# EAGLE design bender_head (EAGLE 7.2.0)
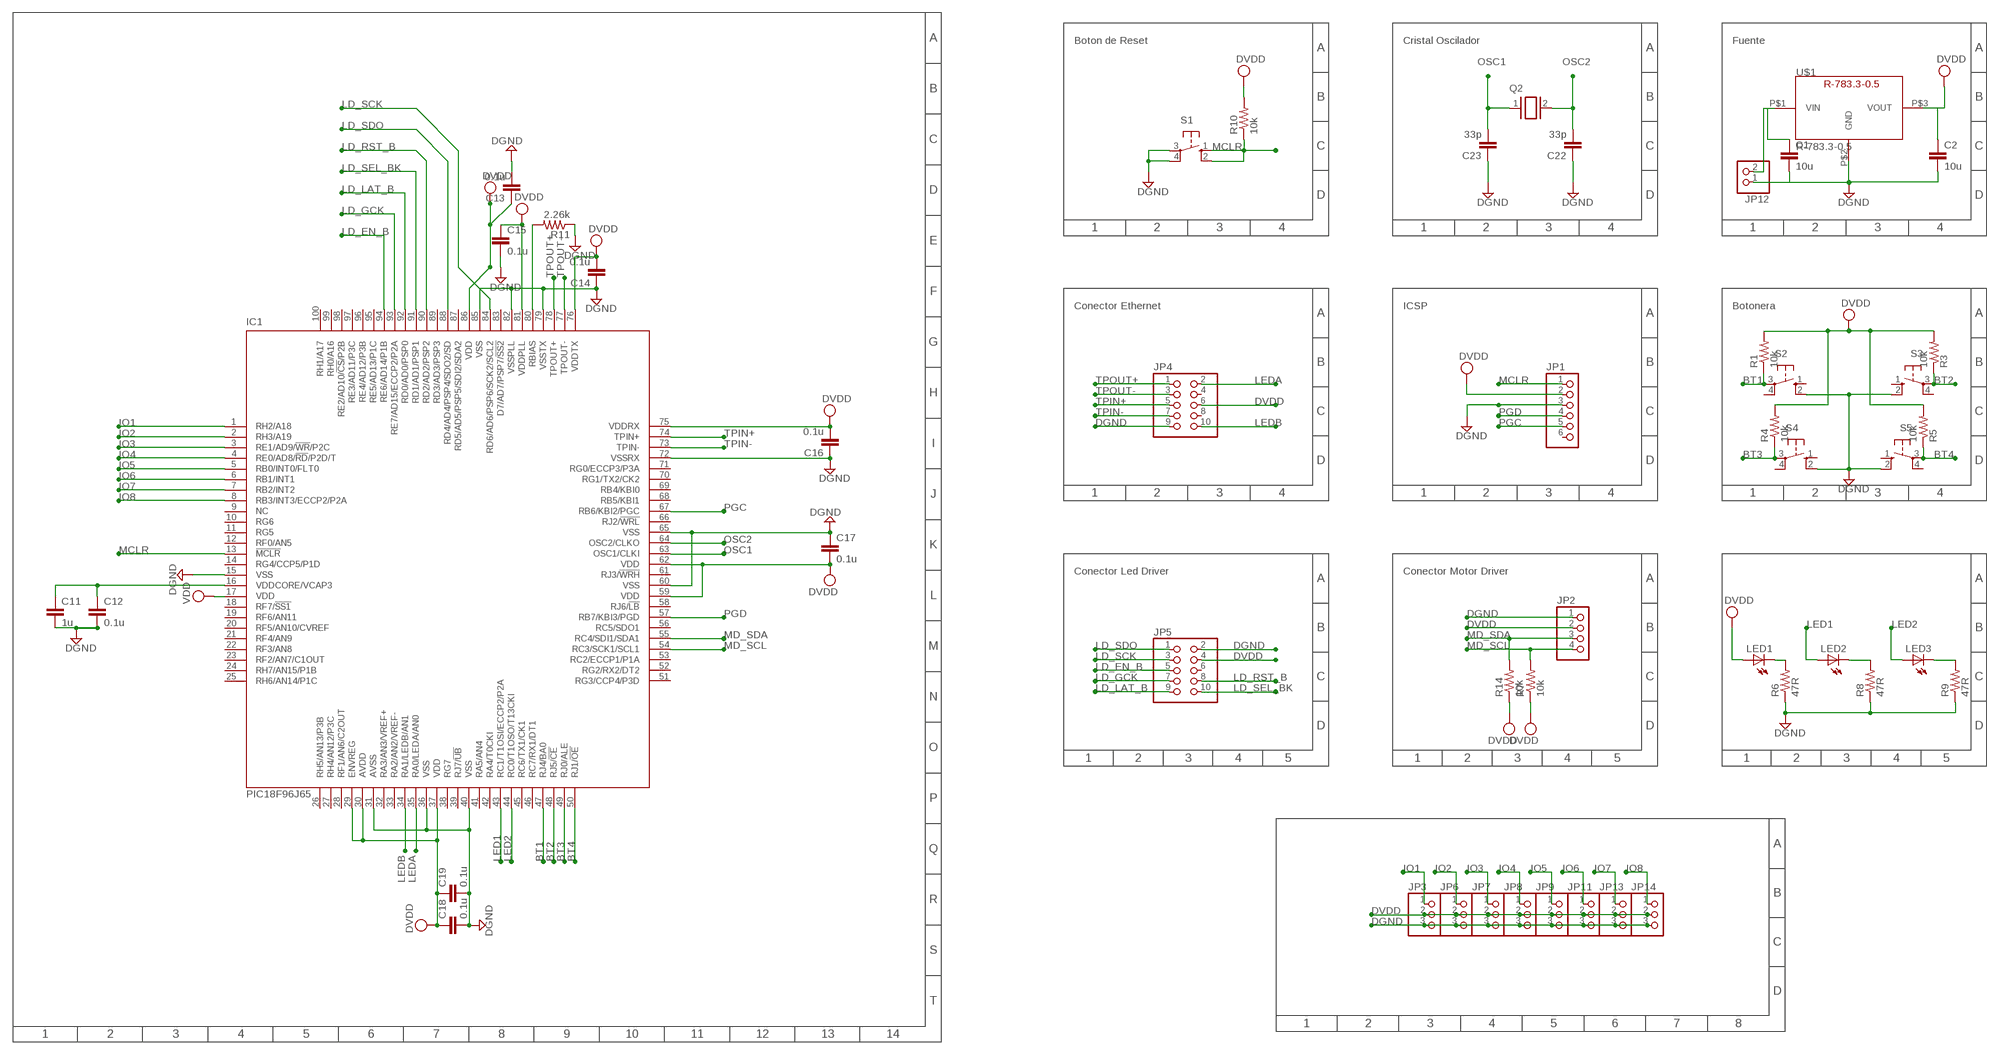
[diagram p0: schematic, sheet 1]

## Parts
C1  10u  C-EUC1206  [C1206]
C2  10u  C-EUC1206  [C1206]
C11  1u  C-EUC1206  [C1206]
C12  0.1u  C-EUC0805  [C0805]
C13  0.1u  C-EUC0805  [C0805]
C14  0.1u  C-EUC0805  [C0805]
C15  0.1u  C-EUC0805  [C0805]
C16  0.1u  C-EUC0805  [C0805]
C17  0.1u  C-EUC0805  [C0805]
C18  0.1u  C-EUC0805  [C0805]
C19  0.1u  C-EUC0805  [C0805]
C22  33p  C-EUC1206  [C1206]
C23  33p  C-EUC1206  [C1206]
IC1  PIC18F96J65  [TQFP100]
JP1  PINHD-1X6  [1X06]
JP2  PINHD-1X4/90  [1X04/90]
JP3  PINHD-1X3  [1X03]
JP4  PINHD-2X5/90  [2X05/90]
JP5  PINHD-2X5/90  [2X05/90]
JP6  PINHD-1X3  [1X03]
JP7  PINHD-1X3  [1X03]
JP8  PINHD-1X3  [1X03]
JP9  PINHD-1X3  [1X03]
JP11  PINHD-1X3  [1X03]
JP12  PINHD-1X2/90  [1X02/90]
JP13  PINHD-1X3  [1X03]
JP14  PINHD-1X3  [1X03]
LED1  LEDSML0805  [SML0805]
LED2  LEDSML0805  [SML0805]
LED3  LEDSML0805  [SML0805]
Q2  XTAL/S  [QS]
R1  10k  R-US_R1206  [R1206]
R3  10k  R-US_R1206  [R1206]
R4  10k  R-US_R1206  [R1206]
R5  10k  R-US_R1206  [R1206]
R6  47R  R-US_M0805  [M0805]
R7  10k  R-US_R1206  [R1206]
R8  47R  R-US_M1206  [M1206]
R9  47R  R-US_M1206  [M1206]
R10  10k  R-US_R1206  [R1206]
R11  2.26k  R-US_R1206  [R1206]
R14  10k  R-US_R1206  [R1206]
S1  10-XX  [B3F-10XX]
S2  10-XX  [B3F-10XX]
S3  10-XX  [B3F-10XX]
S4  10-XX  [B3F-10XX]
S5  10-XX  [B3F-10XX]
U$1  R-783.3-0.5  [R-783.3-0.5]

## Nets
BT1: IC1.47(RJ4/BA0) R1.1 S2.3(P)
BT2: IC1.48(RJ5/!CE) R3.1 S3.3(P)
BT3: IC1.49(RJ0/ALE) R4.1 S4.3(P)
BT4: IC1.50(RJ1/!OE) R5.1 S5.3(P)
DGND: C1.2 C2.2 C11.2 C12.2 C13.2 C14.1 C15.2 C16.1 C17.1 C18.2 C19.2 C22.1 C23.1 IC1.15(VSS) IC1.31(AVSS) IC1.36(VSS) IC1.40(VSS) IC1.60(VSS) IC1.65(VSS) IC1.72(VSSRX) IC1.79(VSSTX) IC1.82(VSSPLL) IC1.85(VSS) JP1.3 JP2.1 JP3.3 JP4.9 JP5.2 JP6.3 JP7.3 JP8.3 JP9.3 JP11.3 JP12.1 JP13.3 JP14.3 R6.1 R8.1 R9.1 R11.1 S1.3(P) S1.4(P1) S2.2(S1) S3.2(S1) S4.2(S1) S5.2(S1) U$1.P$2(GND)
DVDD: C2.1 C13.1 C14.2 C15.1 C16.2 C17.2 C18.1 C19.1 IC1.17(VDD) IC1.29(ENVREG) IC1.30(AVDD) IC1.37(VDD) IC1.59(VDD) IC1.62(VDD) IC1.75(VDDRX) IC1.76(VDDTX) IC1.81(VDDPLL) IC1.86(VDD) JP1.2 JP2.2 JP3.2 JP4.6 JP5.4 JP6.2 JP7.2 JP8.2 JP9.2 JP11.2 JP13.2 JP14.2 LED1.A R1.2 R3.2 R4.2 R5.2 R7.1 R10.2 R14.1 U$1.P$3(VOUT) ; supply symbol labelled VDD
IO1: IC1.1(RH2/A18) JP3.1
IO2: IC1.2(RH3/A19) JP6.1
IO3: IC1.3(RE1/AD9/!WR!/P2C) JP7.1
IO4: IC1.4(RE0/AD8/!RD!/P2D/T) JP8.1
IO5: IC1.5(RB0/INT0/FLT0) JP9.1
IO6: IC1.6(RB1/INT1) JP11.1
IO7: IC1.7(RB2/INT2) JP13.1
IO8: IC1.8(RB3/INT3/ECCP2/P2A) JP14.1
LD_EN_B: IC1.94(RE6/AD14/P1B) JP5.5
LD_GCK: IC1.93(RE7/AD15/ECCP2/P2A) JP5.7
LD_LAT_B: IC1.92(RD0/AD0/PSP0) JP5.9
LD_RST_B: IC1.90(RD2/AD2/PSP2) JP5.8
LD_SCK: IC1.84(RD6/AD6/PSP6/SCK2/SCL2) JP5.3
LD_SDO: IC1.88(RD4/AD4/PSP4/SDO2/SD) JP5.1
LD_SEL_BK: IC1.91(RD1/AD1/PSP1) JP5.10
LED1: IC1.43(RC1/T1OSI/ECCP2/P2A) LED2.A
LED2: IC1.44(RC0/T1OSO/T13CKI) LED3.A
LEDA: IC1.35(RA0/LEDA/AN0) JP4.2
LEDB: IC1.34(RA1/LEDB/AN1) JP4.10
MCLR: IC1.13(!MCLR) JP1.1 R10.1 S1.1(S) S1.2(S1)
MD_SCL: IC1.54(RC3/SCK1/SCL1) JP2.4 R7.2
MD_SDA: IC1.55(RC4/SDI1/SDA1) JP2.3 R14.2
N$1: LED1.C R6.2
N$2: LED2.C R8.2
N$3: LED3.C R9.2
N$8: C11.1 C12.1 IC1.16(VDDCORE/VCAP3)
N$12: IC1.80(RBIAS) R11.2
OSC1: C23.2 IC1.63(OSC1/CLKI) Q2.1
OSC2: C22.2 IC1.64(OSC2/CLKO) Q2.2
PGC: IC1.67(RB6/KBI2/PGC) JP1.5
PGD: IC1.57(RB7/KBI3/PGD) JP1.4
TPIN+: IC1.74(TPIN+) JP4.5
TPIN-: IC1.73(TPIN-) JP4.7
TPOUT+: IC1.78(TPOUT+) JP4.1
TPOUT-: IC1.77(TPOUT-) JP4.3
VIN: C1.1 JP12.2 U$1.P$1(VIN)
Unconnected: IC1.9(NC) IC1.10(RG6) IC1.11(RG5) IC1.12(RF0/AN5) IC1.14(RG4/CCP5/P1D) IC1.18(RF7/!SS1) IC1.19(RF6/AN11) IC1.20(RF5/AN10/CVREF) IC1.21(RF4/AN9) IC1.22(RF3/AN8) IC1.23(RF2/AN7/C1OUT) IC1.24(RH7/AN15/P1B) IC1.25(RH6/AN14/P1C) IC1.26(RH5/AN13/P3B) IC1.27(RH4/AN12/P3C) IC1.28(RF1/AN6/C2OUT) IC1.32(RA3/AN3/VREF+) IC1.33(RA2/AN2/VREF-) IC1.38(RG7) IC1.39(RJ7/!UB) IC1.41(RA5/AN4) IC1.42(RA4/T0CKI) IC1.45(RC6/TX1/CK1) IC1.46(RC7/RX1/DT1) IC1.51(RG3/CCP4/P3D) IC1.52(RG2/RX2/DT2) IC1.53(RC2/ECCP1/P1A) IC1.56(RC5/SDO1) IC1.58(RJ6/!LB) IC1.61(RJ3/!WRH) IC1.66(RJ2/!WRL) IC1.68(RB5/KBI1) IC1.69(RB4/KBI0) IC1.70(RG1/TX2/CK2) IC1.71(RG0/ECCP3/P3A) IC1.83(D7/AD7/PSP7/!SS2) IC1.87(RD5/AD5/PSP5/SDI2/SDA2) IC1.89(RD3/AD3/PSP3) IC1.95(RE5/AD13/P1C) IC1.96(RE4/AD12/P3B) IC1.97(RE3/AD11/P3C) IC1.98(RE2/AD10/!CS!/P2B) IC1.99(RH0/A16) IC1.100(RH1/A17) JP1.6 JP4.4 JP4.8 JP5.6 S2.1(S) S2.4(P1) S3.1(S) S3.4(P1) S4.1(S) S4.4(P1) S5.1(S) S5.4(P1)

## Notes on the sheet
- Boton de Reset | Cristal Oscilador | Fuente
- Conector Ethernet | ICSP | Botonera
- Conector Led Driver | Conector Motor Driver

## Library data of the parts
C1 C2 C11-C19 C22 C23 = rcl:C-EU: CAPACITOR, European symbol
IC1 = microchip:PIC18F9*J6: PIC18F97J60 Family 64/80/100-Pin High-Performance, 1-Mbit Flash Microcontrollers with Ethernet Source: http://ww1.microchip.com/downloads/en/DeviceDoc/39762d.pdf
JP1 = pinhead:PINHD-1X6: PIN HEADER
JP2 = pinhead:PINHD-1X4: PIN HEADER
JP3 JP6-JP9 JP11 JP13 JP14 = pinhead:PINHD-1X3: PIN HEADER
JP4 JP5 = pinhead:PINHD-2X5: PIN HEADER
JP12 = pinhead:PINHD-1X2: PIN HEADER
LED1-LED3 = led:LED: LED OSRAM: - CHIPLED LG R971, LG N971, LY N971, LG Q971, LY Q971, LO R971, LY R971 LH N974, LH R974 LS Q976, LO Q976, LY Q976 LO Q996 - Hyper CHIPLED LW Q18S LB Q993, LB Q99A, LB R99A - SideLED LS A670, LO A670, LY A670, LG A670, LP A670 LB A673, LV A673, LT A673, LW A673 LH A674 LY A675 LS A676, LA A676, LO A676, LY A676, LW A676 LS A679, LY A679, LG A679 - Hyper Micro SIDELED® LS Y876, LA Y876, LO Y876, LY Y876 LT Y87S - SmartLED LW L88C, LW L88S LB L89C, LB L89S, LG L890 LS L89K, LO L89K, LY L89K LS L896, LA L896, LO L896, LY L896 - TOPLED LS T670, LO T670, LY T670, LG T670, LP T670 LSG T670, LSP T670, LSY T670, LOP T670, LYG T670 LG T671, LOG T671, LSG T671 LB T673, LV T673, LT T673, LW T673 LH T674 LS T676, LA T676, LO T676, LY T676, LB T676, LH T676, LSB T676, LW T676 LB T67C, LV T67C, LT T67C, LS T67K, LO T67K, LY T67K, LW E67C LS E67B, LA E67B, LO E67B, LY E67B, LB E67C, LV E67C, LT E67C LW T67C LS T679, LY T679, LG T679 LS T770, LO T770, LY T770, LG T770, LP T770 LB T773, LV T773, LT T773, LW T773 LH T774 LS E675, LA E675, LY E675, LS T675 LS T776, LA T776, LO T776, LY T776, LB T776 LHGB T686 LT T68C, LB T68C - Hyper Mini TOPLED® LB M676 - Mini TOPLED Santana® LG M470 LS M47K, LO M47K, LY M47K Source: http://www.osram.convergy.de LUXEON: - LUMILED® LXK2-PW12-R00, LXK2-PW12-S00, LXK2-PW14-U00, LXK2-PW14-V00 LXK2-PM12-R00, LXK2-PM12-S00, LXK2-PM14-U00 LXK2-PE12-Q00, LXK2-PE12-R00, LXK2-PE12-S00, LXK2-PE14-T00, LXK2-PE14-U00 LXK2-PB12-K00, LXK2-PB12-L00, LXK2-PB12-M00, LXK2-PB14-N00, LXK2-PB14-P00, LXK2-PB14-Q00 LXK2-PR12-L00, LXK2-PR12-M00, LXK2-PR14-Q00, LXK2-PR14-R00 LXK2-PD12-Q00, LXK2-PD12-R00, LXK2-PD12-S00 LXK2-PH12-R00, LXK2-PH12-S00 LXK2-PL12-P00, LXK2-PL12-Q00, LXK2-PL12-R00 Source: www.luxeon.com KINGBRIGHT: KA-3528ASYC Source: www.kingbright.com
Q2 = special:XTAL/S: CRYSTAL
R1 R3-R11 R14 = rcl:R-US_: RESISTOR, American symbol
S1-S5 = switch-omron:10-XX: OMRON SWITCH
U$1 = cabeza_bender:R-783.3-0.5

## Board
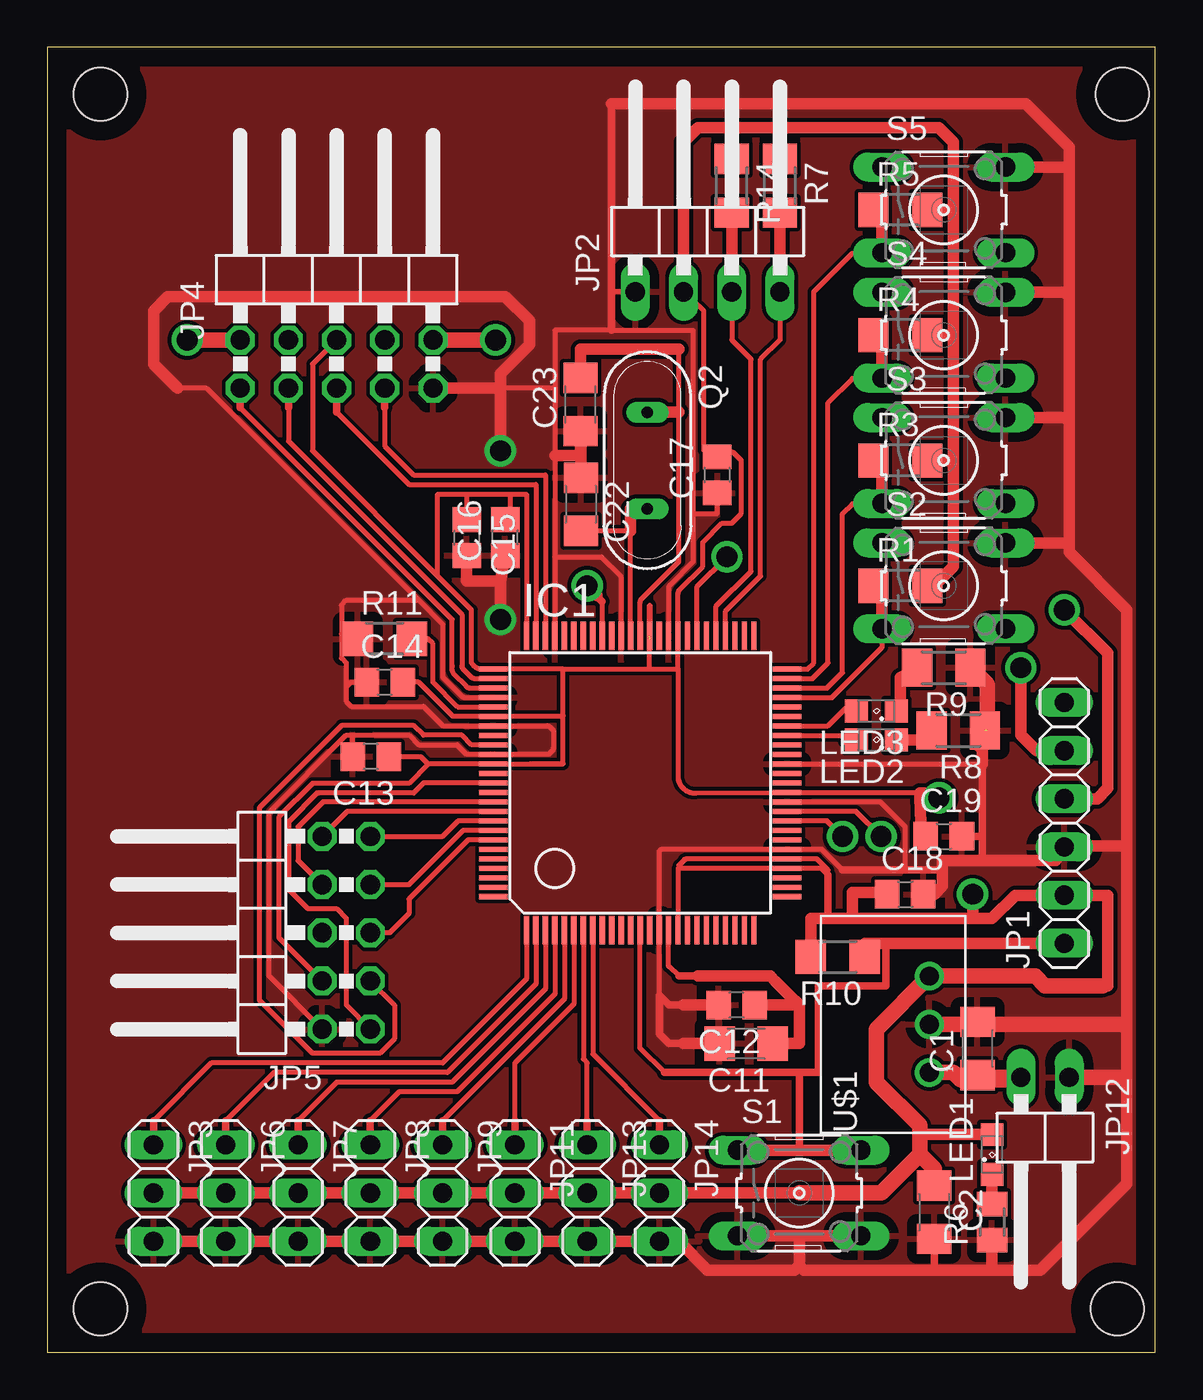
[diagram p1: board, top side]
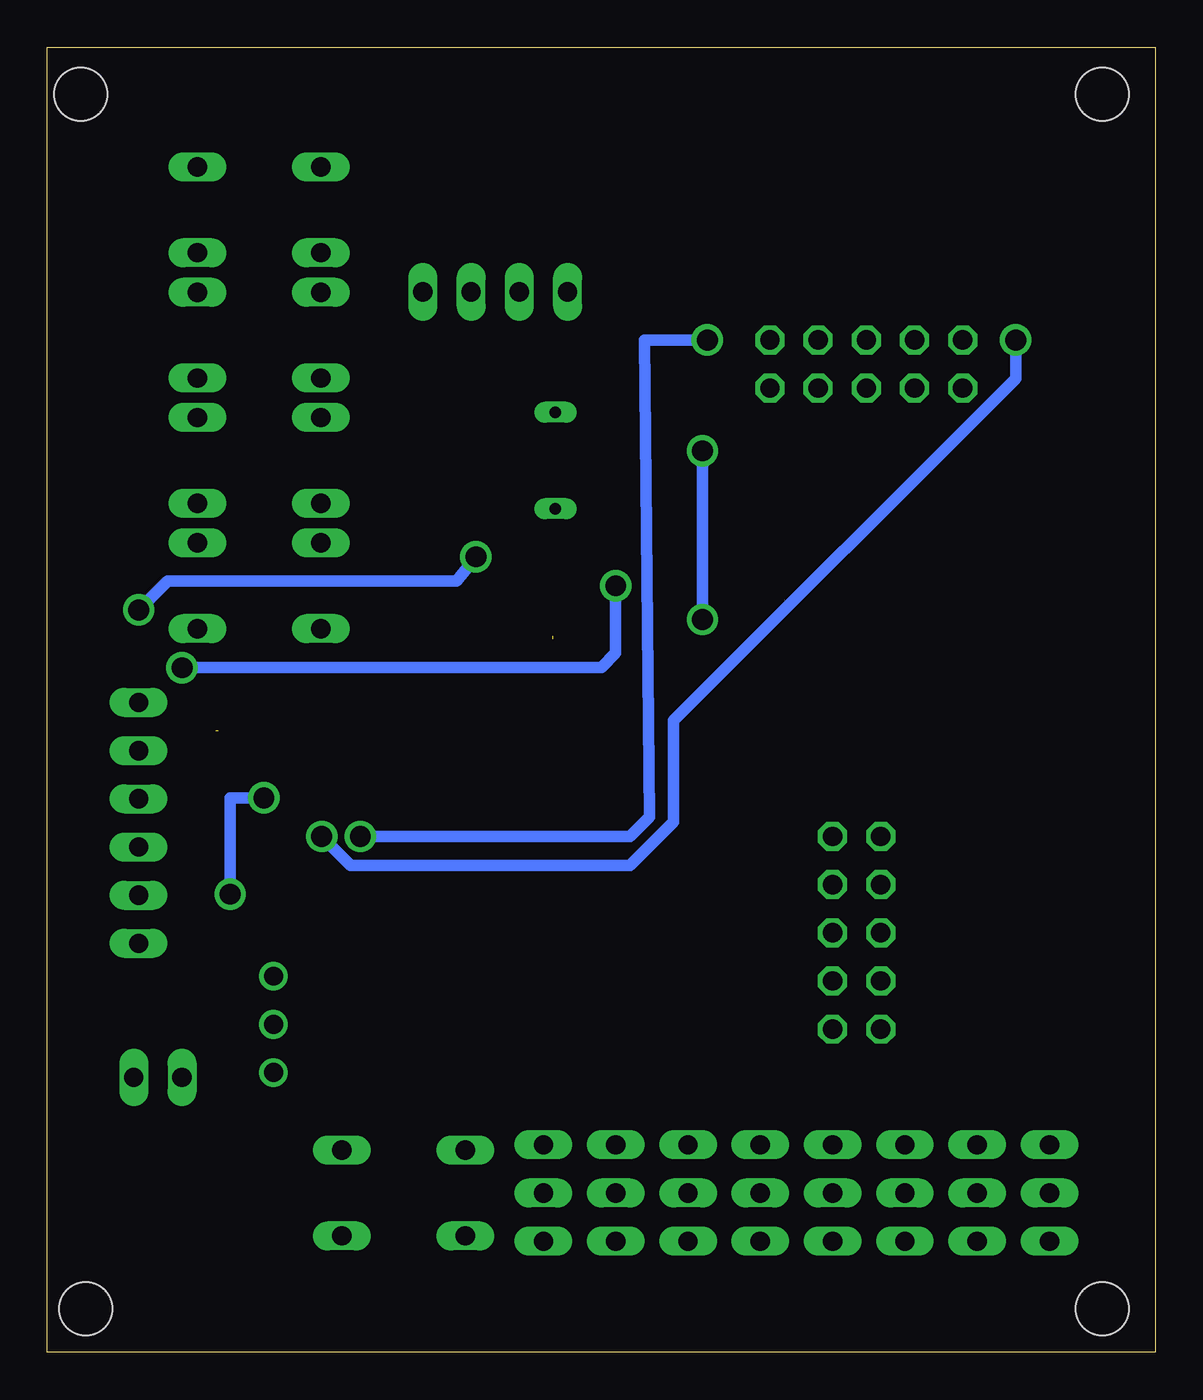
[diagram p2: board, bottom side, seen from below]

Size 58.4 x 68.76 mm. Coordinates in mm from the lower left corner, seen from the top.
Outline: 0,0 58.4,0 58.4,68.76 0,68.76 0,0
Copper layers (1*16): Top 0.035mm / dielectric 1.5mm / Bottom 0.035mm
Design rules "default": minimum track width 10mil, minimum drill 24mil, track to track 8mil, track to pad 8mil, pad to pad 8mil, via to via 8mil, smd to smd 8mil, copper to edge 40mil, drill to drill 8mil, minimum pad ring 10mil, minimum via ring 8mil, stop-mask expansion 4mil, vias tented up to drill 0mil, thermal gap 20mil
Holes 2.8 mm at 2.79,66.29 56.64,66.29 56.39,2.29 2.79,2.29

### Footprints (pad centres in the part's own frame; a part is rotated, then mirrored left to right if it is on the bottom)
C1206 = smd 1.6 x 1.8: 1 -1.4,0; 2 1.4,0
C0805 = smd 1.3 x 1.5: 1 -0.95,0; 2 0.95,0
TQFP100 = smd 0.27 x 1.5: 1 -6,-7.75; 2 -5.5,-7.75; 3 -5,-7.75; 4 -4.5,-7.75; 5 -4,-7.75; 6 -3.5,-7.75; 7 -3,-7.75; 8 -2.5,-7.75; 9 -2,-7.75; 10 -1.5,-7.75; 11 -1,-7.75; 12 -0.5,-7.75; 13 0,-7.75; 14 0.5,-7.75; 15 1,-7.75; 16 1.5,-7.75; 17 2,-7.75; 18 2.5,-7.75; 19 3,-7.75; 20 3.5,-7.75; 21 4,-7.75; 22 4.5,-7.75; 23 5,-7.75; 24 5.5,-7.75; 25 6,-7.75; 51 6,7.75; 52 5.5,7.75; 53 5,7.75; 54 4.5,7.75; 55 4,7.75; 56 3.5,7.75; 57 3,7.75; 58 2.5,7.75; 59 2,7.75; 60 1.5,7.75; 61 1,7.75; 62 0.5,7.75; 63 0,7.75; 64 -0.5,7.75; 65 -1,7.75; 66 -1.5,7.75; 67 -2,7.75; 68 -2.5,7.75; 69 -3,7.75; 70 -3.5,7.75; 71 -4,7.75; 72 -4.5,7.75; 73 -5,7.75; 74 -5.5,7.75; 75 -6,7.75 | smd 1.5 x 0.27: 26 7.75,-6; 27 7.75,-5.5; 28 7.75,-5; 29 7.75,-4.5; 30 7.75,-4; 31 7.75,-3.5; 32 7.75,-3; 33 7.75,-2.5; 34 7.75,-2; 35 7.75,-1.5; 36 7.75,-1; 37 7.75,-0.5; 38 7.75,0; 39 7.75,0.5; 40 7.75,1; 41 7.75,1.5; 42 7.75,2; 43 7.75,2.5; 44 7.75,3; 45 7.75,3.5; 46 7.75,4; 47 7.75,4.5; 48 7.75,5; 49 7.75,5.5; 50 7.75,6; 76 -7.75,6; 77 -7.75,5.5; 78 -7.75,5; 79 -7.75,4.5; 80 -7.75,4; 81 -7.75,3.5; 82 -7.75,3; 83 -7.75,2.5; 84 -7.75,2; 85 -7.75,1.5; 86 -7.75,1; 87 -7.75,0.5; 88 -7.75,0; 89 -7.75,-0.5; 90 -7.75,-1; 91 -7.75,-1.5; 92 -7.75,-2; 93 -7.75,-2.5; 94 -7.75,-3; 95 -7.75,-3.5; 96 -7.75,-4; 97 -7.75,-4.5; 98 -7.75,-5; 99 -7.75,-5.5; 100 -7.75,-6
1X06 = drill 1.016 long: 1 -6.35,0; 2 -3.81,0; 3 -1.27,0; 4 1.27,0; 5 3.81,0; 6 6.35,0
1X04/90 = drill 1.016 long: 1 -3.81,-3.81; 2 -1.27,-3.81; 3 1.27,-3.81; 4 3.81,-3.81
1X03 = drill 1.016 long: 1 -2.54,0; 2 0,0; 3 2.54,0
2X05/90 = drill 1.016 octagon: 1 -5.08,-6.35; 2 -5.08,-3.81; 3 -2.54,-6.35; 4 -2.54,-3.81; 5 0,-6.35; 6 0,-3.81; 7 2.54,-6.35; 8 2.54,-3.81; 9 5.08,-6.35; 10 5.08,-3.81
1X02/90 = drill 1.016 long: 1 -1.27,-3.81; 2 1.27,-3.81
SML0805 = smd 1.2 x 1.2: A 1.05,0; C -1.05,0
QS = drill 0.61 long: 1 -2.54,0; 2 2.54,0
R1206 = smd 1.6 x 1.803: 1 -1.422,0; 2 1.422,0
M0805 = smd 1.3 x 1.6: 1 -0.95,0; 2 0.95,0
M1206 = smd 1.6 x 2: 1 -1.4,0; 2 1.4,0
B3F-10XX = drill 1.016 long: 1 -3.251,2.261; 2 3.251,2.261; 3 -3.251,-2.261; 4 3.251,-2.261
R-783.3-0.5 = drill 1: P$1 -2.54,-2.54; P$2 0,-2.54; P$3 2.54,-2.54

### Placement (x,y rotation side)
C1  49.02,16 90 top
C2  46.74,7.37 270 top
C11  36.83,16.26 180 top
C12  36.32,18.29 180 top
C13  17.05,31.38 180 top
C14  17.78,35.31 0 top
C15  22.1,42.93 270 top
C16  24.13,42.93 90 top
C17  35.31,46.23 90 top
C18  45.21,24.13 0 top
C19  47.24,27.18 0 top
C22  28.12,44.68 270 top
C23  28.09,49.94 90 top
IC1  31.24,30 0 top
JP1  53.59,27.89 90 top
JP2  34.8,59.69 0 top
JP3  5.59,8.38 270 top
JP4  15.24,57.15 0 top
JP5  10.67,22.1 90 top
JP6  9.4,8.38 270 top
JP7  13.21,8.38 270 top
JP8  17.02,8.38 270 top
JP9  20.83,8.38 270 top
JP11  24.64,8.38 270 top
JP12  52.58,10.67 180 top
JP13  28.45,8.38 270 top
JP14  32.26,8.38 270 top
LED1  49.78,10.41 90 top
LED2  43.69,32.26 180 top
LED3  43.69,33.78 180 top
Q2  31.62,46.99 270 top
R1  44.96,40.39 0 top
R3  44.96,46.99 0 top
R4  44.96,53.59 0 top
R5  44.96,60.2 0 top
R6  49.78,6.86 90 top
R7  38.61,61.47 270 top
R8  48.01,32.77 180 top
R9  47.24,36.07 180 top
R10  41.66,20.83 180 top
R11  17.78,37.59 0 top
R14  36.07,61.47 270 top
S1  39.62,8.38 0 top
S2  47.24,40.39 0 top
S3  47.24,46.99 0 top
S4  47.24,53.59 0 top
S5  47.24,60.2 0 top
U$1  43.94,17.27 90 top

### Tracks (layer width: path | path; a pad name or v marks a point on that pad's centre or on a via)
BT1
  Top 0.254: IC1.47 41.36,34.5 43.99,37.13 S2.3
  Top 0.61: S2.3 43.99,39.93 R1.1
BT2
  Top 0.254: IC1.48 41.09,35 41.91,35.81 41.91,44.2 42.42,44.7 43.97,44.7 S3.3
  Top 0.61: S3.3 43.99,46.53 R3.1
BT3
  Top 0.254: IC1.49 40.32,35.5 41.15,36.32 41.15,50.04 42.42,51.31 43.97,51.31 S4.3
  Top 0.61: S4.3 43.99,53.14 R4.1
BT4
  Top 0.254: IC1.50 40.06,36 40.39,36.32 40.39,55.88 42.42,57.91 43.97,57.91 S5.3
  Top 0.61: S5.3 43.99,59.74 R5.1
DGND  (via drill 1.1)  (2 unrouted)
  Top 0.254: 26.74,41.91 IC1.72 | 26.74,41.91 26.74,47.24 26.74,50.8 | 34.04,44.2 35.31,44.2 C17.1 | 34.04,44.2 34.04,53.85 29.72,53.85 26.74,53.85 26.74,50.8 | 26.74,50.8 23.88,50.8 | 41.91,25.4 40.81,26.5 IC1.31 32.42,26.5 arc90 32.24,26.32 IC1.15 32.24,18.81 32.26,18.8 | 48.26,25.91 48.19,25.97 | IC1.36 43.9,29 45.21,27.69 45.21,25.4 | IC1.60 32.74,40.26 arc-45 32.82,40.44 34.04,41.66 34.04,44.2 | IC1.65 30.24,40.77 arc45 30.17,40.95 29.21,41.91 26.74,41.91 | IC1.79 22,34.5 arc-45 21.82,34.57 20.9,35.49 arc-45 20.83,35.66 20.83,38.35 19.56,39.62 15.75,39.62 15.49,39.37 15.49,37.85 | 19.56,39.63 8.38,50.8 6.86,50.8 | 15.49,37.85 15.75,37.59 R11.1 | 15.75,35.05 16,35.31 C14.1 | 15.75,35.05 15.75,36.32 15.49,36.58 15.49,37.85 | 15.75,35.05 15.75,34.29 16,34.04 19.81,34.04 20.85,33 IC1.82 26.33,33 arc-45 26.51,32.92 26.67,32.77 26.67,31.86 arc-45 26.6,31.68 26.42,31.5 IC1.85 arc-45 IC1.85 22.1,31.5 21.59,32 19.56,32 19.05,32.51 16,32.51 | 23.62,50.8 23.88,50.55 | JP2.1 29.72,55.88 | IC1.40 48.25,31 49.28,30.99 | 56.64,17.27 56.9,17.27 | 56.64,14.48 56.9,14.48 | C13.2 16.1,32.42 16,32.51 | 16,32.51 15.75,32.51 11.68,28.45 11.68,19.81 JP5.2
  Top 0.406: 56.9,8.87 56.9,8.89 | 53.59,26.67 JP1.3 | 29.72,65.79 29.72,55.88 29.72,53.85 | 47.18,25.4 45.21,25.4 41.91,25.4 | 49.28,25.91 49.28,27.18 | 49.28,27.18 49.28,30.99 | 49.28,27.18 C19.2 | 33.53,16.26 32.77,16.26 32.26,16.76 32.26,18.8 32.77,18.29 33.53,18.29 | C1.2 48.01,17.4 48.01,17.27 | C2.2 46.74,4.32
  Top 0.61: C15.2 22.1,40.64 23.88,40.64 | 23.88,40.64 C16.1 | v23.88,38.61 23.88,40.64 | v23.88,47.5 23.88,50.55 23.88,50.8 23.88,51.56 25.4,53.09 25.4,54.36 24.13,55.63 6.35,55.63 5.59,54.86 5.59,52.07 6.86,50.8 | 56.9,8.87 52.32,4.32 49.78,4.32 | 39.62,4.57 39.62,6.12 | 49.78,4.32 46.74,4.32 39.88,4.32 39.62,4.57 | S1.4 39.62,6.12 | 39.62,6.12 S1.3 | 56.9,8.89 56.9,14.48 56.9,17.27 56.9,26.67 | 56.9,26.67 56.9,39.12 53.85,42.16 53.85,42.42 | 53.85,42.42 53.85,49.02 | 53.85,49.02 53.85,55.63 | 53.85,55.63 53.85,62.48 | 53.85,62.48 53.85,63.5 51.56,65.79 29.72,65.79 | 56.9,26.67 53.59,26.67 | JP1.3 53.14,25.91 49.28,25.91 48.26,25.91 47.18,25.91 47.18,25.4 47.18,24.57 46.74,24.13 C18.2 | 33.53,16.26 C11.2 | 33.53,18.29 C12.2 | C22.1 28.12,48.51 C23.1 28.09,47.24 26.74,47.24 | JP4.9 23.62,50.8 | S5.2 53.82,62.46 53.85,62.48 | S4.2 53.62,55.86 53.85,55.63 | S3.2 53.62,49.25 53.85,49.02 | S2.2 53.62,42.65 53.85,42.42 | JP3.3 JP6.3 JP7.3 JP8.3 JP9.3 JP11.3 JP13.3 JP14.3 33.27,5.84 34.8,4.32 39.37,4.32 39.62,4.57 | R8.1 48.96,32.07 49.28,31.75 49.28,30.99 | R6.1 49.78,4.32
  Top 0.813: U$1.P$2 48.01,17.27 56.64,17.27 | JP12.1 56.64,14.48 | R9.1 49.53,35.18 49.53,32.77
  Bottom 0.61: v23.88,47.5 v23.88,38.61
  pour Top: 0.51,68.58 0.51,0.25 58.17,0.25 58.17,68.58
DVDD  (via drill 1.1)  (1 unrouted)
  Top 0.254: 27.18,31 IC1.86 20.08,31 20.07,30.99 | 27.18,31 25.4,30.99 | 27.18,31 27.18,33.53 | 33.24,36 IC1.59 33.24,40 arc-45 33.32,40.17 34.54,41.4 34.54,42.67 35.56,43.69 36.07,43.69 36.58,44.2 36.58,46.99 36.21,47.36 arc45 36.03,47.43 35.31,47.43 C17.2 35.05,46.67 34.59,47.53 34.59,54.86 34.04,55.42 JP2.2 | 44.26,24.23 C18.1 | 42.42,24.08 42.42,24.23 | IC1.75 25.24,45.21 24.38,45.21 | 22.1,45.21 24.38,45.21 | 22.1,45.21 C15.1 | C16.2 24.38,43.88 24.38,45.21 | 20.57,40.89 20.57,45.21 22.1,45.21 | 20.57,40.89 22.35,39.12 22.35,37.08 22.35,36.33 arc45 22.78,36 IC1.76 27.18,36 | IC1.17 33.24,25.5 IC1.29 40.8,25.5 41.15,25.15 41.15,25.4 40.55,26 IC1.30 33.72,26 arc45 33.54,25.92 33.27,25.65 33.27,25.43 | 27.18,33.53 27.18,36 | 27.18,36 31.74,36 | 31.74,36 33.24,36 | 33.24,36 33.24,30.48 arc90 34.01,29.46 34.17,29.46 IC1.37 45.97,29.5 45.97,29.46 | 41.15,22.86 41.15,23.11 | 46.04,27.87 C19.1 | C14.2 19.56,35.31 21.37,33.5 IC1.81 27.15,33.5 27.18,33.53 | 31.74,36 31.74,39.36 31.75,39.37 31.75,37.59 | JP4.6 13.97,52.07 13.97,47.5 20.57,40.89 | 35.97,62.99 R14.1 | C13.1 19.68,31.38 20.07,30.99 | 20.07,30.99 19.05,29.97 13.97,29.97 12.19,28.19 12.19,21.84 JP5.4 | 55.63,19.3 55.88,19.3
  Top 0.406: 41.15,23.11 41.15,25.15
  Top 0.61: 42.42,24.23 44.26,24.23 | R10.2 40.23,22.86 41.15,22.86 42.42,22.86 | 42.42,22.86 42.42,24.08 | 48.77,22.86 42.42,22.86 | 55.88,19.3 55.88,24.08 JP1.2 51,24.08 49.78,22.86 48.77,22.86 | v46.99,29.21 46.48,29.21 46.23,29.46 45.97,29.46 45.97,29.21 46.04,27.87 | v48.77,24.13 48.77,22.86 | JP2.2 33.53,63.75 34.29,64.52 36.32,64.52 | 36.32,64.52 38.61,64.52 | 38.61,64.52 46.99,64.52 47.75,63.75 47.75,60.2 | 47.75,60.2 47.75,53.59 | 47.75,53.59 47.75,46.99 | 47.75,46.99 47.75,41.4 46.74,40.39 R1.2 | R14.1 36.07,64.26 36.32,64.52 | R7.1 38.61,64.52 | R3.2 47.75,46.99 | R4.2 47.75,53.59 | R5.2 47.75,60.2 | JP3.2 JP6.2 JP7.2 JP8.2 JP9.2 JP11.2 JP13.2 JP14.2 39.62,8.38 | LED1.A 46.01,11.46 45.97,11.43
  Top 0.813: 55.63,19.3 52.58,19.3 52.07,19.81 U$1.P$3 43.69,17.02 43.69,14.22 45.97,11.94 45.97,11.43 45.97,10.41 | 39.62,8.38 43.94,8.38 45.97,10.41 | 45.97,10.41 46.74,9.65 C2.1
  Bottom 0.61: v48.77,24.13 48.77,29.21 v46.99,29.21
IO1
  Top 0.254: 5.59,12.19 8.64,15.24 20.83,15.24 25.24,19.65 IC1.1
  Top 0.406: 5.59,12.19 JP3.1
IO2
  Top 0.254: 9.4,12.19 11.94,14.73 21.08,14.73 25.74,19.39 IC1.2
  Top 0.406: JP6.1 9.4,12.19
IO3
  Top 0.254: 13.21,12.19 15.24,14.22 21.34,14.22 26.24,19.13 IC1.3
  Top 0.406: JP7.1 13.21,12.19
IO4
  Top 0.254: 17.02,12.19 18.54,13.72 21.59,13.72 26.74,18.87 IC1.4
  Top 0.406: JP8.1 17.02,12.19
IO5
  Top 0.254: IC1.5 27.24,18.61 20.83,12.19
  Top 0.406: JP9.1 20.83,12.19
IO6
  Top 0.254: IC1.6 27.74,18.34 24.64,15.24 24.64,12.19
  Top 0.406: JP11.1 24.64,12.19
IO7
  Top 0.254: IC1.7 28.24,15.45 28.45,15.24 28.45,12.19
  Top 0.406: JP13.1 28.45,12.19
IO8
  Top 0.254: IC1.8 28.74,15.71 32.26,12.19
  Top 0.406: JP14.1 32.26,12.19
LD_EN_B
  Top 0.254: IC1.94 22.17,27 19.05,23.88 19.05,23.11 18.03,22.1 JP5.5
LD_GCK
  Top 0.254: JP5.7 19.05,24.64 21.91,27.5 IC1.93
LD_LAT_B
  Top 0.254: JP5.9 20.83,27.18 21.65,28 IC1.92
LD_RST_B
  Top 0.254: IC1.90 14.52,29 13.21,27.69 13.21,25.91 JP5.8
LD_SCK
  Top 0.254: IC1.84 22.36,32 21.84,32.51 19.81,32.51 19.3,33.02 15.49,33.02 11.18,28.7 11.18,18.54 13.97,15.75 17.53,15.75 18.29,16.51 18.29,18.29 JP5.3
LD_SDO
  Top 0.254: JP5.1 15.75,18.29 15.75,22.86 15.24,23.37 13.72,23.37 12.7,24.38 12.7,27.94 14.25,29.49 14.28,29.46 19.3,29.46 19.84,30 IC1.88
LD_SEL_BK
  Top 0.254: IC1.91 15.8,28.5 JP5.10
LED1
  Top 0.254: IC1.43 41.92,32.5 42.16,32.26
  Top 0.61: 42.16,32.26 LED2.A
LED2
  Top 0.254: IC1.44 41.12,33 42.16,34.04 LED3.A
LEDA  (via drill 1.1)
  Top 0.254: IC1.35 42.62,28.5 v43.94,27.18
  Top 0.813: v7.37,53.34 JP4.2
  Bottom 0.61: v43.94,27.18 42.42,25.65 27.69,25.65 25.4,27.94 25.4,33.27 7.37,51.31 v7.37,53.34
LEDB  (via drill 1.1)
  Top 0.254: IC1.34 41.09,28 v41.91,27.18
  Top 0.813: JP4.10 v23.62,53.34
  Bottom 0.61: v23.62,53.34 26.92,53.34 26.67,28.19 27.69,27.18 v41.91,27.18
MCLR
  Top 0.254: IC1.13 31.24,16 32.51,14.73
  Top 0.406: 39.62,14.73 40.64,14.73 40.64,19.3 44.2,19.3 44.2,21.54 | 39.62,14.73 32.51,14.73 | 39.62,10.64 39.62,14.73
  Top 0.61: S1.1 39.62,10.64 S1.2 | JP1.1 44.2,21.54 43.08,21.54 R10.1
MD_SCL
  Top 0.254: IC1.54 35.74,39.04 37.59,40.89 37.59,52.32 38.61,53.34 JP2.4
  Top 0.61: JP2.4 R7.2
MD_SDA
  Top 0.254: IC1.55 35.24,39.31 37.08,41.15 37.08,52.32 36.07,53.34 JP2.3
  Top 0.61: JP2.3 R14.2
N$1
  Top 0.61: LED1.C R6.2
N$2
  Top 0.61: LED2.C 46.8,32.26 R8.2
N$3
  Top 0.61: LED3.C 44.96,34.04 44.96,35.56 R9.2
N$8
  Top 0.254: IC1.16 32.74,20.32 32.77,20.32 33.27,19.81
  Top 0.406: 34.29,19.81 33.27,19.81
  Top 0.61: C11.1 39.62,16.26 39.62,18.29 | C12.1 39.62,18.29 | 39.62,18.29 39.12,18.8 38.35,19.56 38.1,19.81 34.29,19.81
N$12
  Top 0.254: IC1.80 21.63,34 20.32,35.31 20.32,37.34 20.07,37.59 R11.2
OSC1
  Top 0.254: 33.27,52.86 33.27,49.53 33.27,41.66 31.32,39.7 arc45 31.24,39.52 IC1.63
  Top 0.61: 33.27,49.53 Q2.1 | 33.27,52.86 28.09,52.86 C23.2
OSC2
  Top 0.254: IC1.64 30.74,43.28 C22.2
  Top 0.61: Q2.2 30.74,44.45 30.74,43.28
PGC  (via drill 1.1)
  Top 0.254: 29.24,39.55 IC1.67
  Top 0.406: 28.96,39.88 arc45 28.99,39.8 29.24,39.55
  Top 0.61: v28.45,40.39 28.96,39.88 | JP1.5 52.12,31.7 51.31,32.51 v51.31,36.07
  Bottom 0.61: v51.31,36.07 29.21,36.07 28.45,36.83 v28.45,40.39
PGD  (via drill 1.1)
  Top 0.254: IC1.57 34.24,40.34 v35.81,41.91
  Top 0.61: 53.29,29.16 JP1.4 55.32,29.16 55.88,29.72 55.88,36.83 v53.59,39.12
  Bottom 0.61: v35.81,41.91 36.83,40.64 52.07,40.64 v53.59,39.12
TPIN+
  Top 0.254: IC1.74 25.74,45.72 19.05,45.72 15.24,49.53
  Top 0.406: JP4.5 15.24,49.53
TPIN-
  Top 0.254: IC1.73 26.24,46.23 19.3,46.23 17.78,47.75 17.78,49.78
  Top 0.406: JP4.7 17.78,49.78
TPOUT+
  Top 0.254: 22.08,35.07 21.41,35.74 arc-45 21.34,36.17 21.34,38.61 10.16,49.78 | IC1.78 22.26,35 arc-45 22.08,35.07 | 22.08,35.07 22.1,35.05
  Top 0.406: JP4.1 10.16,49.78
TPOUT-
  Top 0.254: IC1.77 22.52,35.5 arc-45 22.34,35.57 21.92,35.99 arc-45 21.84,36.17 21.84,38.86 12.7,48.01 12.7,49.78
  Top 0.406: JP4.3 12.7,49.78
VIN
  Top 0.406: C1.1 49.02,14.48
  Top 0.813: U$1.P$1 47.75,14.73 48.13,14.35 | 48.13,14.35 51.21,14.33 | JP12.2 49.02,14.48 48.26,14.48 48.13,14.35